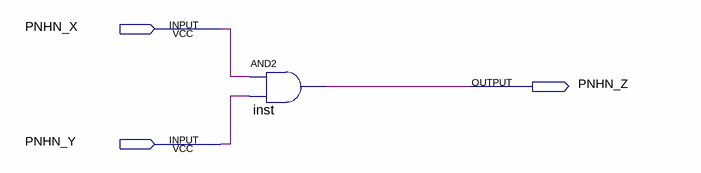
[diagram p0: schematic sheet]
// Quartus schematic Assignment1.bdf as structural Verilog: 1 symbols, 3 pins
module Assignment1 (
  input  PNHN_X,
  input  PNHN_Y,
  output PNHN_Z
);

  and inst (PNHN_Z, PNHN_X, PNHN_Y);
endmodule
